# EAGLE design meanwell-irm (EAGLE 9.3.2)

## Sheet 1 of 2
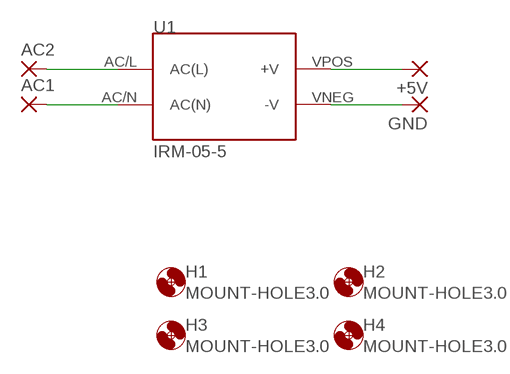
[diagram p0: schematic, sheet 1]

### Parts
+5V  3,81/1,4  [3,81/1,4]
AC1  3,81/1,4  [3,81/1,4]
AC2  3,81/1,4  [3,81/1,4]
GND  3,81/1,4  [3,81/1,4]
H1  MOUNT-HOLE3.0  [3,0]
H2  MOUNT-HOLE3.0  [3,0]
H3  MOUNT-HOLE3.0  [3,0]
H4  MOUNT-HOLE3.0  [3,0]
U1  IRM-05-5  [CONV_IRM-05-5]

### Nets
N$1: AC2.1(P) U1.AC/L(AC(L))
N$2: AC1.1(P) U1.AC/N(AC(N))
N$3: +5V.1(P) U1.VPOS(+V)
N$4: GND.1(P) U1.VNEG(-V)

## Sheet 2 of 2

## Library data of the parts
+5V AC1 AC2 GND = wirepad:3,81/1,4: THROUGH-HOLE PAD
H1-H4 = holes:MOUNT-HOLE: MOUNTING HOLE with drill center marker
U1 = IRM-05-5:IRM-05-5: AC-DC Single output Encapsulated power supply; Output 5Vdc at 1.0A; PCB mount, miniature size; AVAILABILITY: Unavailable; DESCRIPTION: AC-DC Single output Encapsulated power supply; Output 5Vdc at 1.0A; PCB mount, miniature size; MF: MEAN WELL; MP: IRM-05-5; PACKAGE: DIP-4 Mean Well; PRICE: None

## Board
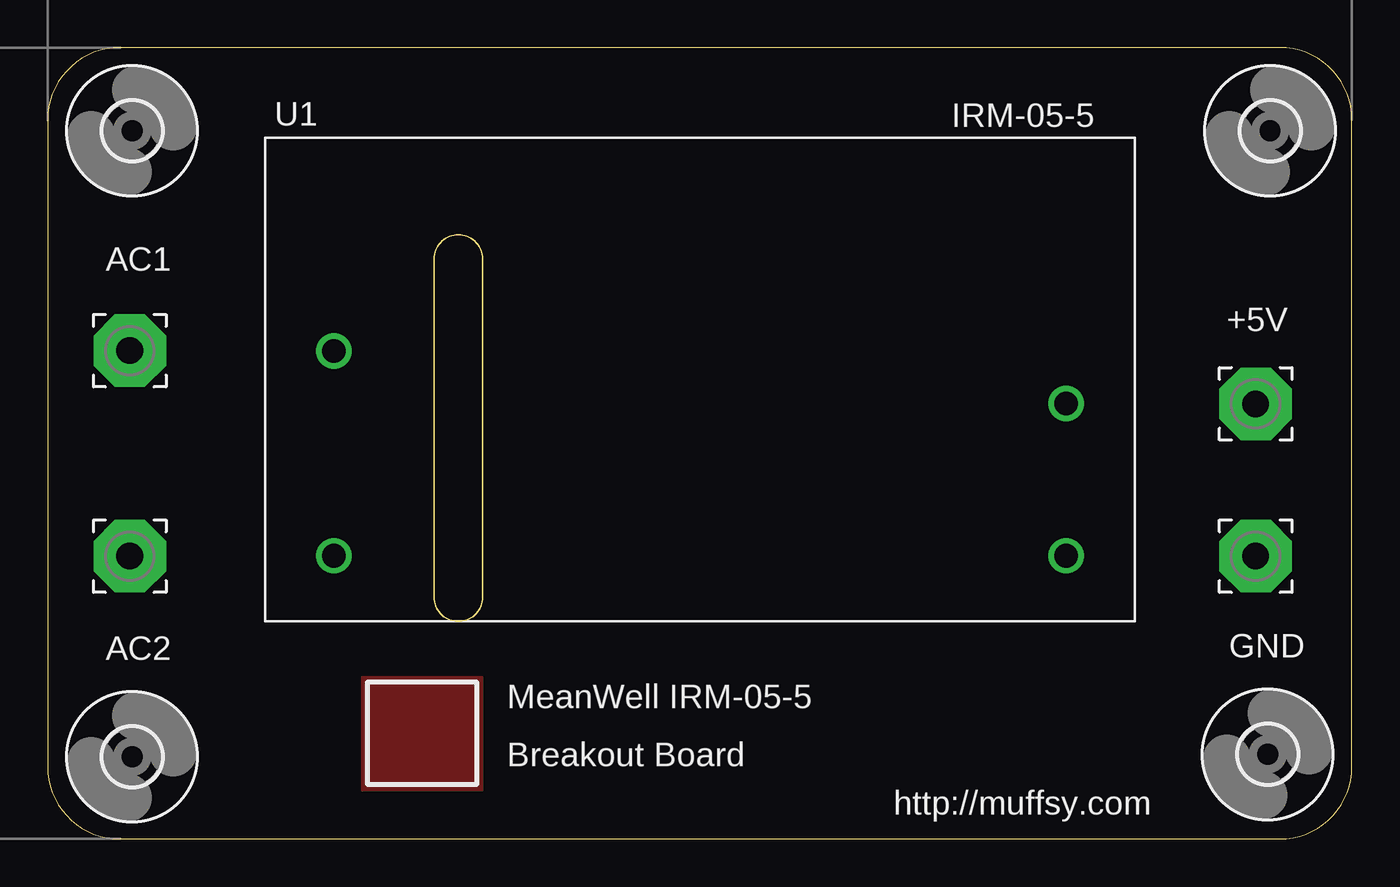
[diagram p1: board, top side]
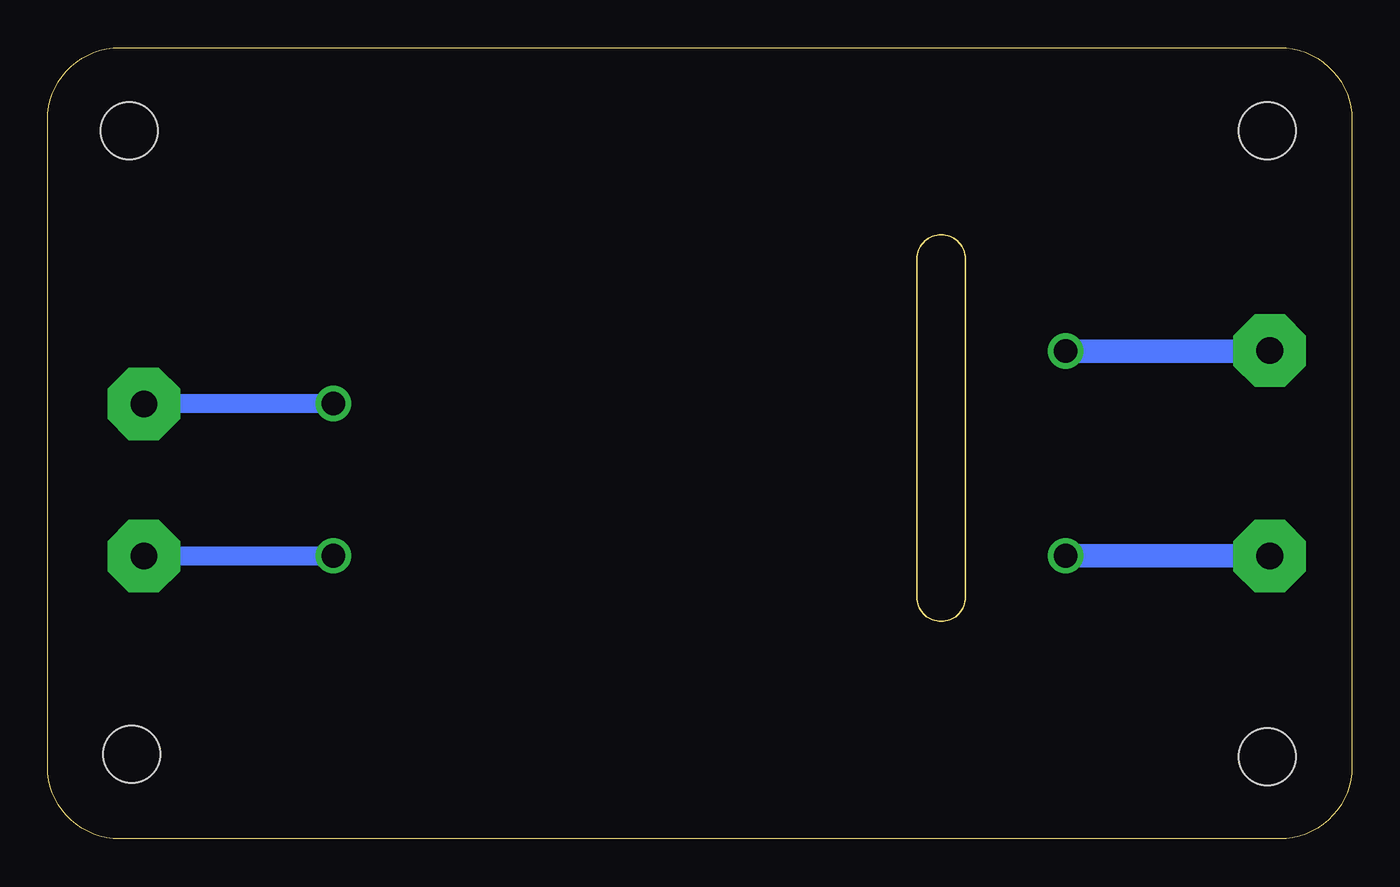
[diagram p2: board, bottom side, seen from below]

Size 68.56 x 41.58 mm. Coordinates in mm from the lower left corner, seen from the top.
Outline: 0,37.77 0,3.81 arc90 3.81,0 64.77,0 arc90 68.56,3.79 68.56,37.79 arc90 64.77,41.58 3.81,41.58 arc90 0,37.77
Copper layers (1*16): Top 0.035mm / dielectric 1.5mm / Bottom 0.035mm
Design rules "default": minimum track width 6mil, minimum drill 0.35mm, track to track 6mil, track to pad 6mil, pad to pad 6mil, via to via 6mil, smd to smd 6mil, copper to edge 40mil, drill to drill 6mil, minimum pad ring 10mil, minimum via ring 8mil, stop-mask expansion 4mil, vias tented up to drill 0mil, thermal gap 10mil
Milling: area 20.3,11.4 to 22.9,31.8

### Footprints (pad centres in the part's own frame; a part is rotated, then mirrored left to right if it is on the bottom)
3,81/1,4 = drill 1.397 pad 3.81 octagon: 1 0,0
3,0 = hole 3: 0,0
CONV_IRM-05-5 = drill 1.24: AC/L -19.25,-9.25; AC/N -19.25,1.5; VNEG 19.25,-9.25; VPOS 19.25,-1.25

### Placement (x,y rotation side)
+5V  63.5,22.86 0 top
AC1  4.32,25.65 0 top
AC2  4.32,14.86 0 top
GND  63.5,14.86 0 top
H1  64.14,4.45 0 top
H2  64.26,37.21 0 top
H3  4.45,4.32 0 top
H4  4.45,37.21 0 top
U1  34.29,24.13 0 top

### Tracks (layer width: path | path; a pad name or v marks a point on that pad's centre or on a via)
N$1
  Bottom 1.27: AC2.1 U1.AC/L
N$2
  Bottom 1.016: U1.AC/N
  Bottom 1.27: U1.AC/N AC1.1
N$3
  Bottom 1.016: +5V.1 U1.VPOS
N$4
  Bottom 1.016: GND.1 U1.VNEG
TOP
  pour Top: 16.51,8.51 16.51,2.54 22.86,2.54 22.86,8.51

### Text on the board
tNames: MeanWell IRM-05-5 | Breakout Board | http://muffsy.com